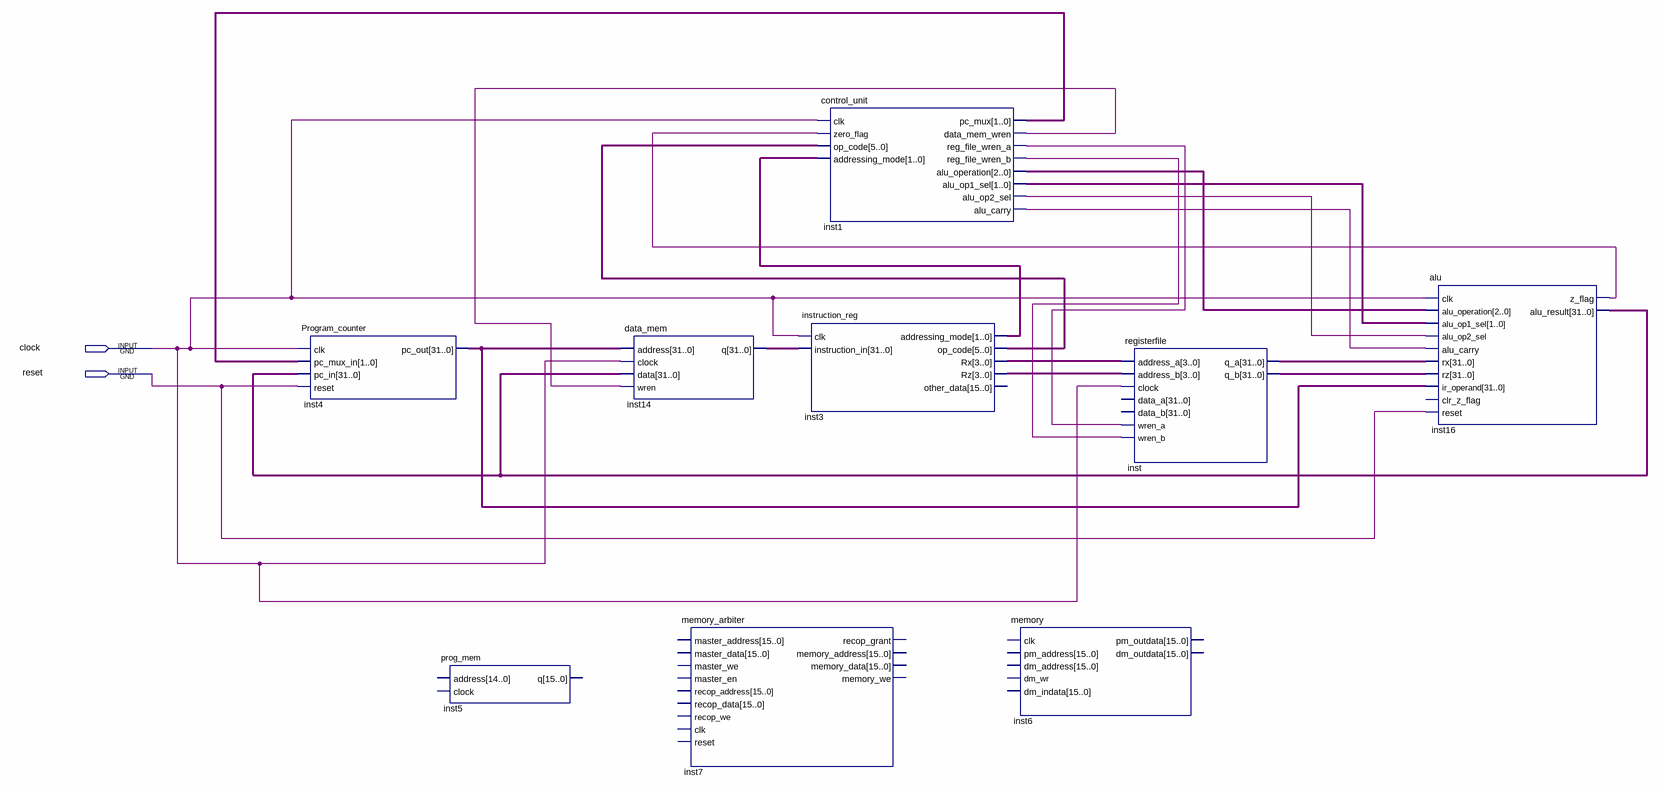
[diagram p0: schematic sheet]
// Quartus schematic RECoP.bdf as structural Verilog: 9 symbols, 2 pins
module RECoP (
  input  clock,
  input  reset
);

  wire inst1_alu_carry, inst1_alu_op2_sel, inst1_data_mem_wren, inst1_reg_file_wren_a, inst1_reg_file_wren_b,
       inst16_z_flag;
  wire [1:0] inst1_alu_op1_sel, inst1_pc_mux, inst3_addressing_mode;
  wire [2:0] inst1_alu_operation;
  wire [3:0] inst3_rx, inst3_rz;
  wire [5:0] inst3_op_code;
  wire [31:0] inst4_pc_out, inst14_q, inst16_alu_result, inst_q_a, inst_q_b;

  Program_counter inst4 (
    .clk(clock), .pc_mux_in(inst1_pc_mux), .pc_in(inst16_alu_result), .reset(reset), .pc_out(inst4_pc_out));
  prog_mem inst5 ();  // open: address, clock, q
  data_mem inst14 (
    .address(inst4_pc_out), .clock(clock), .data(inst16_alu_result), .wren(inst1_data_mem_wren), .q(inst14_q));
  memory_arbiter inst7 ();  // open: master_address, master_data, master_we, master_en, recop_address, recop_data, recop_we, clk, reset, recop_grant, memory_address, memory_data, memory_we
  control_unit inst1 (
    .clk(clock), .zero_flag(inst16_z_flag), .op_code(inst3_op_code), .addressing_mode(inst3_addressing_mode),
    .pc_mux(inst1_pc_mux), .data_mem_wren(inst1_data_mem_wren), .reg_file_wren_a(inst1_reg_file_wren_a),
    .reg_file_wren_b(inst1_reg_file_wren_b), .alu_operation(inst1_alu_operation),
    .alu_op1_sel(inst1_alu_op1_sel), .alu_op2_sel(inst1_alu_op2_sel), .alu_carry(inst1_alu_carry));
  instruction_reg inst3 (
    .clk(clock), .instruction_in(inst14_q), .addressing_mode(inst3_addressing_mode), .op_code(inst3_op_code),
    .Rx(inst3_rx), .Rz(inst3_rz));  // open: other_data
  memory inst6 ();  // open: clk, pm_address, dm_address, dm_wr, dm_indata, pm_outdata, dm_outdata
  registerfile inst (
    .address_a(inst3_rx), .address_b(inst3_rz), .clock(clock), .wren_a(inst1_reg_file_wren_a),
    .wren_b(inst1_reg_file_wren_b), .q_a(inst_q_a), .q_b(inst_q_b));  // open: data_a, data_b
  alu inst16 (
    .clk(clock), .alu_operation(inst1_alu_operation), .alu_op1_sel(inst1_alu_op1_sel),
    .alu_op2_sel(inst1_alu_op2_sel), .alu_carry(inst1_alu_carry), .rx(inst_q_a), .rz(inst_q_b),
    .ir_operand(inst4_pc_out), .reset(reset), .z_flag(inst16_z_flag), .alu_result(inst16_alu_result));  // open: clr_z_flag
endmodule
